# EAGLE schematic Laser PCB (EAGLE 6.5.0)
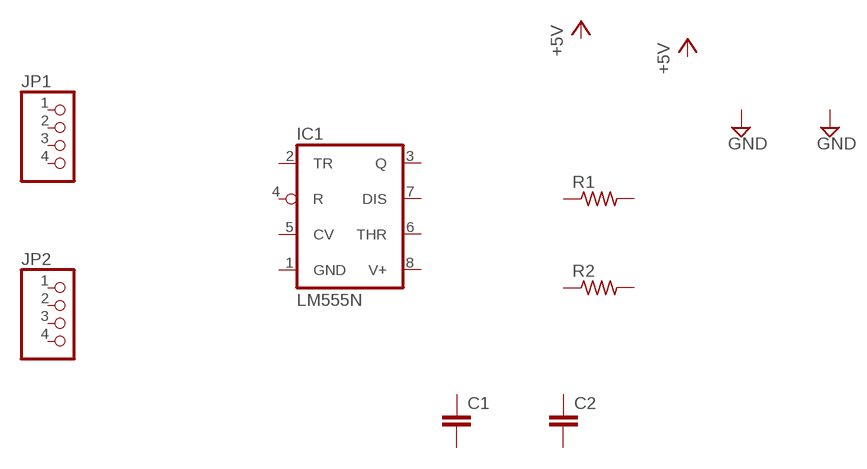
[diagram p0: schematic, sheet 1]

## Parts
C1  C5/3  [C5B3]
C2  C5/3  [C5B3]
IC1  LM555N  [DIL08]
JP1  PINHD-1X4  [1X04]
JP2  PINHD-1X4  [1X04]
R1  R-US_0207/7  [0207/7]
R2  R-US_0207/7  [0207/7]
Unconnected: C1.1 C1.2 C2.1 C2.2 IC1.2(TR) IC1.3(Q) IC1.4(R) IC1.5(CV) IC1.6(THR) IC1.7(DIS) JP1.1 JP1.2 JP1.3 JP1.4 JP2.1 JP2.2 JP2.3 JP2.4 R1.1 R1.2 R2.1 R2.2

## Power pins joined to a net without a drawn wire
GND: IC1.1(GND)
V+: IC1.8(V+)

## Library data of the parts
C1 C2 = capacitor-wima:C: CAPACITOR naming: grid - package width
IC1 = linear:*555: TIMER
JP1 JP2 = pinhead:PINHD-1X4: PIN HEADER
R1 R2 = resistor:R-US_: RESISTOR, American symbol